# Altium schematic sheet FPGA.SchDoc
size A3; DocumentNumber: 4; SheetNumber: 4; SheetTotal: 30
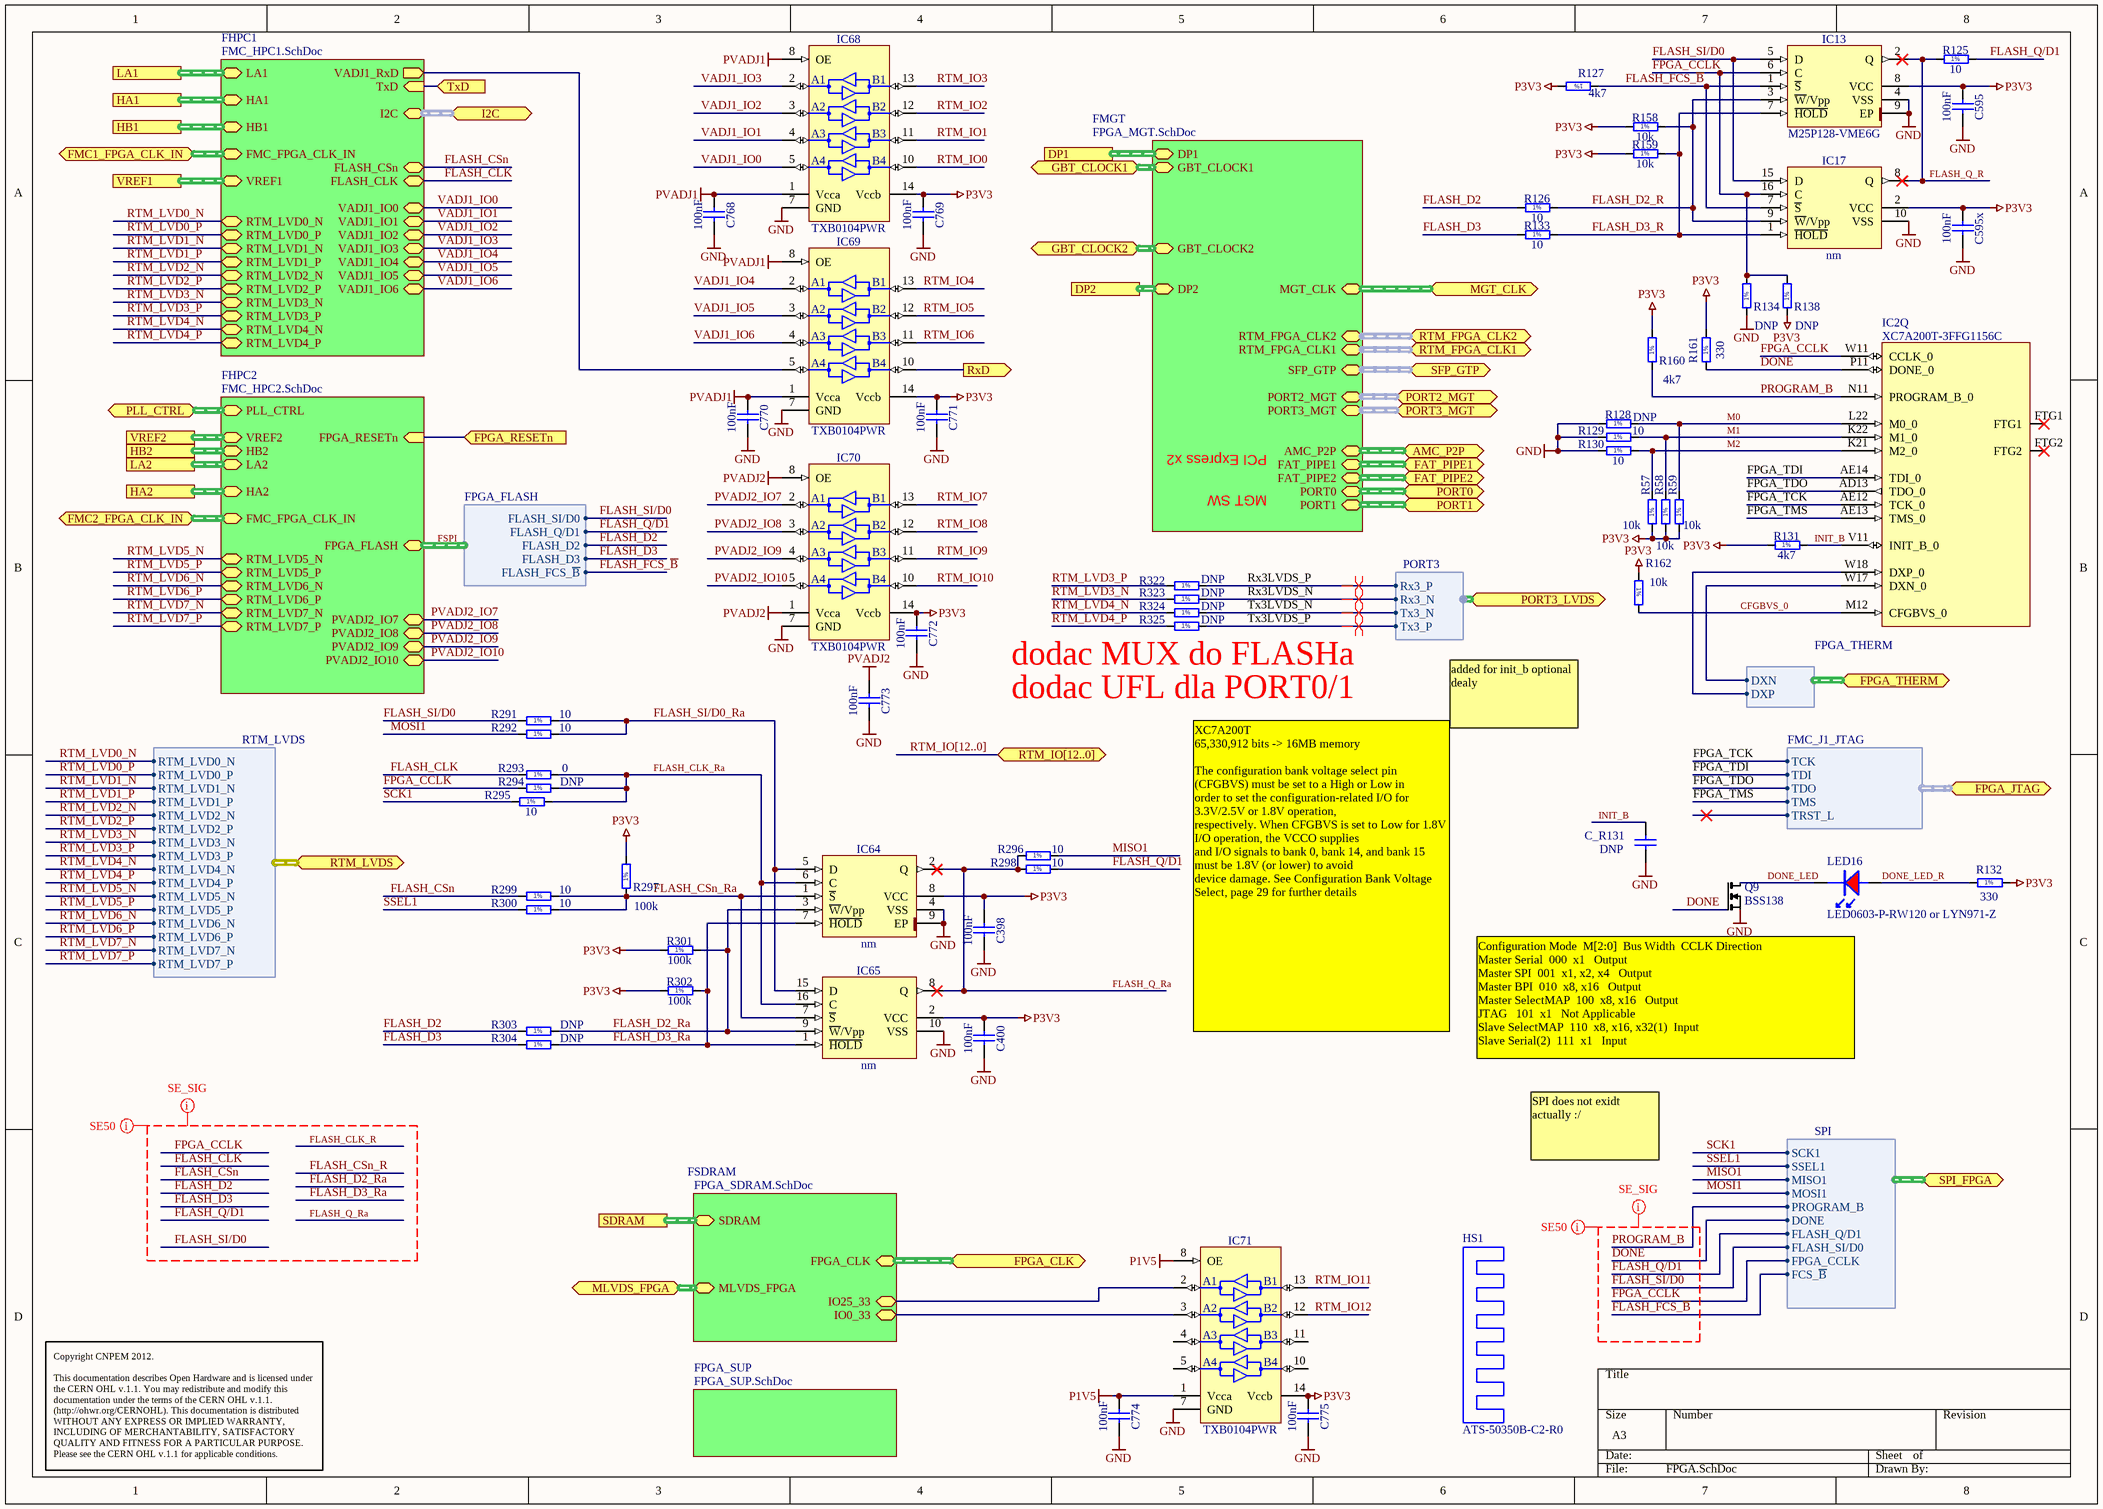
[diagram p0: FPGA.SchDoc]

## Parts
C398  100nF  [CAPC0603X33N]
C400  100nF  [CAPC0603X33N]
C595  100nF  [CAPC0603X33N]
C595x  100nF  [CAPC0603X33N]
C768  100nF  [CAPC0603X33N]
C769  100nF  [CAPC0603X33N]
C770  100nF  [CAPC0603X33N]
C771  100nF  [CAPC0603X33N]
C772  100nF  [CAPC0603X33N]
C773  100nF  [CAPC0603X33N]
C774  100nF  [CAPC0603X33N]
C775  100nF  [CAPC0603X33N]
C_R131  DNP  [CAPC1608X87N]
HS1  ATS-50350B-C2-R0  [HEAT_SINK_ATS-50350B-C2-R0]
IC2  XC7A200T-3FFG1156C  [BGA1156C100P34X34_3500X3500X335]  (part Q of 23)
IC13  M25P128-VME6G  [PSON127P800X600X100-9N-R640X480]
IC17  nm  [SOIC127P1030X265-16N]
IC64  nm  [PSON127P800X600X100-9N-R640X480]
IC65  nm  [SOIC127P1030X265-16N]
IC68  TXB0104PWR  [SOP65P640X120-14N]
IC69  TXB0104PWR  [SOP65P640X120-14N]
IC70  TXB0104PWR  [SOP65P640X120-14N]
IC71  TXB0104PWR  [SOP65P640X120-14N]
LED16  LED0603-P-RW120 or LYN971-Z  [led_0603R]
Q9  BSS138  [SOT95P251X112-3N]
R57  10k  [RESC1005X40N]
R58  10k  [RESC1005X40N]
R59  10k  [RESC1005X40N]
R125  10  [RESC1005X40N]
R126  10  [RESC1005X40N]
R127  4k7  [RESC1005X40N]
R128  DNP  [RESC1005X40N]
R129  10  [RESC1005X40N]
R130  10  [RESC1005X40N]
R131  4k7  [RESC1005X40N]
R132  330  [RESC1005X40N]
R133  10  [RESC1005X40N]
R134  DNP  [RESC1005X40N]
R138  DNP  [RESC1005X40N]
R158  10k  [RESC1005X40N]
R159  10k  [RESC1005X40N]
R160  4k7  [RESC1005X40N]
R161  330  [RESC1005X40N]
R162  10k  [RESC1005X40N]
R291  10  [RESC1005X40N]
R292  10  [RESC1005X40N]
R293  0  [RESC1005X40N]
R294  DNP  [RESC1005X40N]
R295  10  [RESC1005X40N]
R296  10  [RESC1005X40N]
R297  100k  [RESC1005X40N]
R298  10  [RESC1005X40N]
R299  10  [RESC1005X40N]
R300  10  [RESC1005X40N]
R301  100k  [RESC1005X40N]
R302  100k  [RESC1005X40N]
R303  DNP  [RESC1005X40N]
R304  DNP  [RESC1005X40N]
R322  DNP  [RESC1005X40N]
R323  DNP  [RESC1005X40N]
R324  DNP  [RESC1005X40N]
R325  DNP  [RESC1005X40N]

## Sub-sheets
FHPC1 = FMC_HPC1.SchDoc: LA1 (harness FMC_J1_LA), HA1 (harness FMC_J1_HA), HB1 (harness FMC_J1_HB), VREF1 (harness FMC_J1_VREF), FMC_FPGA_CLK_IN (harness FMC_FPGA_CLK_IN), I2C (harness I2C), FLASH_CLK, FLASH_CSn, VADJ1_RxD (out), TxD (in), VADJ1_IO0, VADJ1_IO1, VADJ1_IO2, VADJ1_IO3, VADJ1_IO4, VADJ1_IO5, VADJ1_IO6, RTM_LVD0_N (bidir), RTM_LVD0_P (bidir), RTM_LVD1_N (bidir), RTM_LVD1_P (bidir), RTM_LVD2_N (bidir), RTM_LVD2_P (bidir), RTM_LVD3_N (bidir), RTM_LVD3_P (bidir), RTM_LVD4_N (bidir), RTM_LVD4_P (bidir)
FHPC2 = FMC_HPC2.SchDoc: VREF2 (harness FMC_J1_VREF), HB2 (harness FMC_J1_HB), LA2 (harness FMC_J1_LA), HA2 (harness FMC_J1_HA), FPGA_FLASH (harness FPGA_FLASH), FMC_FPGA_CLK_IN (harness FMC_FPGA_CLK_IN), PLL_CTRL (harness PLL_CTRL), FPGA_RESETn (in), PVADJ2_IO7, PVADJ2_IO8, PVADJ2_IO9, PVADJ2_IO10, RTM_LVD5_N (bidir), RTM_LVD5_P (bidir), RTM_LVD6_N (bidir), RTM_LVD6_P (bidir), RTM_LVD7_N (bidir), RTM_LVD7_P (bidir)
FMGT = FPGA_MGT.SchDoc: DP1 (harness FMC_J1_DP), DP2 (harness FMC_J1_DP), FAT_PIPE1 (harness FAT_PIPE1), FAT_PIPE2 (harness FAT_PIPE2), PORT0 (harness PORT0), PORT1 (harness PORT1), GBT_CLOCK1 (harness GBT_CLOCK), GBT_CLOCK2 (harness GBT_CLOCK), MGT_CLK (harness MGT_CLK), PORT2_MGT, PORT3_MGT, SFP_GTP, RTM_FPGA_CLK2 (harness CLK_DIFF), RTM_FPGA_CLK1 (harness CLK_DIFF), AMC_P2P
FPGA_SUP = FPGA_SUP.SchDoc: no entries
FSDRAM = FPGA_SDRAM.SchDoc: SDRAM (harness DDR), MLVDS_FPGA (harness MLVDS-FPGA), FPGA_CLK (harness FPGA_SDRAM_CLK), IO25_33 (bidir), IO0_33 (bidir)

## Ports
AMC_P2P (harness AMC_P2P), DP1, DP2, FAT_PIPE1, FAT_PIPE2, FMC1_FPGA_CLK_IN, FMC2_FPGA_CLK_IN, FPGA_CLK, FPGA_JTAG (harness FMC_J1_JTAG), FPGA_RESETn (in), FPGA_THERM (harness FPGA_THERM), GBT_CLOCK1, GBT_CLOCK2, HA1, HA2, HB1, HB2, I2C (harness I2C), LA1, LA2, MGT_CLK, MLVDS_FPGA, PLL_CTRL (harness PLL_CTRL), PORT0, PORT1, PORT2_MGT (harness PORT2), PORT3_LVDS (harness PORT3), PORT3_MGT (harness PORT3), RTM_FPGA_CLK1 (harness CLK_DIFF), RTM_FPGA_CLK2 (harness CLK_DIFF), RTM_IO[12..0] (bidir), RTM_LVDS (harness RTM_LVDS), RxD (out), SDRAM (harness DDR), SFP_GTP (harness SFP_GTP), SPI_FPGA (harness SPI), TxD (in), VREF1 (harness FMC_J1_VREF), VREF2 (harness FMC_J1_VREF)

## Harnesses
FMC_J1_JTAG: TCK, TDI, TDO, TMS, TRST_L
FPGA_THERM: DXN, DXP
SPI: SCK1, SSEL1, MISO1, MOSI1, FLASH_Q/D1, FLASH_SI/D0, PROGRAM_B, DONE, FPGA_CCLK, FCS_~{B}
FPGA_FLASH: FLASH_FCS_~{B}, FLASH_D3, FLASH_D2, FLASH_Q/D1, FLASH_SI/D0
RTM_LVDS: RTM_LVD0_N, RTM_LVD0_P, RTM_LVD1_N, RTM_LVD1_P, RTM_LVD2_N, RTM_LVD2_P, RTM_LVD3_N, RTM_LVD3_P, RTM_LVD4_N, RTM_LVD4_P, RTM_LVD5_N, RTM_LVD5_P, RTM_LVD6_N, RTM_LVD6_P, RTM_LVD7_N, RTM_LVD7_P
PORT3: Rx3_P, Rx3_N, Tx3_N, Tx3_P

## Nets
GND: C398.2 C400.2 C595.2 C595x.2 C768.2 C769.2 C770.2 C771.2 C772.2 C773.2 C774.2 C775.2 C_R131.1 IC13.4(VSS) IC13.9(EP) IC17.10(VSS) IC64.4(VSS) IC64.9(EP) IC65.10(VSS) IC68.7(GND) IC69.7(GND) IC70.7(GND) IC71.7(GND) Q9.2(S) R128.1 R129.1 R130.1 R134.1
P1V5: C774.1 IC71.1(Vcca) IC71.8(OE)
P3V3: C398.1 C400.1 C595.1 C595x.1 C769.1 C771.1 C772.1 C775.1 IC13.8(VCC) IC17.2(VCC) IC64.8(VCC) IC65.2(VCC) IC68.14(Vccb) IC69.14(Vccb) IC70.14(Vccb) IC71.14(Vccb) R57.1 R58.1 R59.1 R127.2 R131.1 R132.2 R138.1 R158.1 R159.1 R160.2 R161.2 R162.1 R297.2 R301.1 R302.1
PVADJ1: C768.1 C770.1 IC68.1(Vcca) IC68.8(OE) IC69.1(Vcca) IC69.8(OE)
PVADJ2: C773.1 IC70.1(Vcca) IC70.8(OE)
CFGBVS_0: IC2.M12(CFGBVS_0) R162.2
DONE: IC2.P11(DONE_0) Q9.1(G) R161.1 ; port SPI_FPGA.DONE
DONE_LED: LED16.K Q9.3(D)
DONE_LED_R: LED16.A R132.1
FLASH_CLK: R293.1 ; sheet FHPC1/FLASH_CLK
FLASH_CLK_Ra: IC64.6(C) IC65.16(C) R293.2 R294.2 R295.2
FLASH_CSn: R299.1 ; sheet FHPC1/FLASH_CSn
FLASH_CSn_Ra: IC64.1(~{S}) IC65.7(~{S}) R297.1 R299.2 R300.2
FLASH_D2: R126.1 R303.1 ; sheet FHPC2/FPGA_FLASH.FLASH_D2
FLASH_D2_R: IC13.3(~{W}/Vpp) IC17.9(~{W}/Vpp) R126.2 R158.2
FLASH_D2_Ra: IC64.3(~{W}/Vpp) IC65.9(~{W}/Vpp) R301.2 R303.2
FLASH_D3: R133.1 R304.1 ; sheet FHPC2/FPGA_FLASH.FLASH_D3
FLASH_D3_R: IC13.7(~{HOLD}) IC17.1(~{HOLD}) R133.2 R159.2
FLASH_D3_Ra: IC64.7(~{HOLD}) IC65.1(~{HOLD}) R302.2 R304.2
FLASH_FCS_~{B}: IC13.1(~{S}) IC17.7(~{S}) R127.1 ; port SPI_FPGA.FCS_~{B}, sheet FHPC2/FPGA_FLASH.FLASH_FCS_~{B}
FLASH_Q/D1: R125.2 R298.2 ; port SPI_FPGA.FLASH_Q/D1, sheet FHPC2/FPGA_FLASH.FLASH_Q/D1
FLASH_Q_R: IC13.2(Q) IC17.8(Q) R125.1
FLASH_Q_Ra: IC64.2(Q) IC65.8(Q) R296.1 R298.1
FLASH_SI/D0: IC13.5(D) IC17.15(D) R291.1 ; port SPI_FPGA.FLASH_SI/D0, sheet FHPC2/FPGA_FLASH.FLASH_SI/D0
FLASH_SI/D0_Ra: IC64.5(D) IC65.15(D) R291.2 R292.2
FPGA_CCLK: IC2.W11(CCLK_0) IC13.6(C) IC17.16(C) R134.2 R138.2 R294.1 ; port SPI_FPGA.FPGA_CCLK
FPGA_RESETn: port FPGA_RESETn, sheet FHPC2/FPGA_RESETn
FPGA_TCK: IC2.AE12(TCK_0) ; port FPGA_JTAG.TCK
FPGA_TDI: IC2.AE14(TDI_0) ; port FPGA_JTAG.TDI
FPGA_TDO: IC2.AD13(TDO_0) ; port FPGA_JTAG.TDO
FPGA_TMS: IC2.AE13(TMS_0) ; port FPGA_JTAG.TMS
INIT_B: C_R131.2 IC2.V11(INIT_B_0) R131.2
M0: IC2.L22(M0_0) R59.2 R128.2
M1: IC2.K22(M1_0) R58.2 R129.2
M2: IC2.K21(M2_0) R57.2 R130.2
MISO1: R296.2 ; port SPI_FPGA.MISO1
MOSI1: R292.1 ; port SPI_FPGA.MOSI1
PROGRAM_B: IC2.N11(PROGRAM_B_0) R160.1 ; port SPI_FPGA.PROGRAM_B
PVADJ2_IO7: IC70.2(A1) ; sheet FHPC2/PVADJ2_IO7
PVADJ2_IO8: IC70.3(A2) ; sheet FHPC2/PVADJ2_IO8
PVADJ2_IO9: IC70.4(A3) ; sheet FHPC2/PVADJ2_IO9
PVADJ2_IO10: IC70.5(A4) ; sheet FHPC2/PVADJ2_IO10
RTM_IO0: IC68.10(B4)
RTM_IO1: IC68.11(B3)
RTM_IO2: IC68.12(B2)
RTM_IO3: IC68.13(B1)
RTM_IO4: IC69.13(B1)
RTM_IO5: IC69.12(B2)
RTM_IO6: IC69.11(B3)
RTM_IO7: IC70.13(B1)
RTM_IO8: IC70.12(B2)
RTM_IO9: IC70.11(B3)
RTM_IO10: IC70.10(B4)
RTM_IO11: IC71.13(B1)
RTM_IO12: IC71.12(B2)
RTM_LVD0_N: sheet FHPC1/RTM_LVD0_N, port RTM_LVDS.RTM_LVD0_N
RTM_LVD0_P: sheet FHPC1/RTM_LVD0_P, port RTM_LVDS.RTM_LVD0_P
RTM_LVD1_N: sheet FHPC1/RTM_LVD1_N, port RTM_LVDS.RTM_LVD1_N
RTM_LVD1_P: sheet FHPC1/RTM_LVD1_P, port RTM_LVDS.RTM_LVD1_P
RTM_LVD2_N: sheet FHPC1/RTM_LVD2_N, port RTM_LVDS.RTM_LVD2_N
RTM_LVD2_P: sheet FHPC1/RTM_LVD2_P, port RTM_LVDS.RTM_LVD2_P
RTM_LVD3_N: R323.1 ; sheet FHPC1/RTM_LVD3_N, port RTM_LVDS.RTM_LVD3_N
RTM_LVD3_P: R322.1 ; sheet FHPC1/RTM_LVD3_P, port RTM_LVDS.RTM_LVD3_P
RTM_LVD4_N: R324.1 ; sheet FHPC1/RTM_LVD4_N, port RTM_LVDS.RTM_LVD4_N
RTM_LVD4_P: R325.1 ; sheet FHPC1/RTM_LVD4_P, port RTM_LVDS.RTM_LVD4_P
RTM_LVD5_N: sheet FHPC2/RTM_LVD5_N, port RTM_LVDS.RTM_LVD5_N
RTM_LVD5_P: sheet FHPC2/RTM_LVD5_P, port RTM_LVDS.RTM_LVD5_P
RTM_LVD6_N: sheet FHPC2/RTM_LVD6_N, port RTM_LVDS.RTM_LVD6_N
RTM_LVD6_P: sheet FHPC2/RTM_LVD6_P, port RTM_LVDS.RTM_LVD6_P
RTM_LVD7_N: sheet FHPC2/RTM_LVD7_N, port RTM_LVDS.RTM_LVD7_N
RTM_LVD7_P: sheet FHPC2/RTM_LVD7_P, port RTM_LVDS.RTM_LVD7_P
Rx3LVDS_N: R323.2 ; port PORT3_LVDS.Rx3_N
Rx3LVDS_P: R322.2 ; port PORT3_LVDS.Rx3_P
RxD: IC69.10(B4) ; port RxD
SCK1: R295.1 ; port SPI_FPGA.SCK1
SSEL1: R300.1 ; port SPI_FPGA.SSEL1
Tx3LVDS_N: R324.2 ; port PORT3_LVDS.Tx3_N
Tx3LVDS_P: R325.2 ; port PORT3_LVDS.Tx3_P
TxD: port TxD, sheet FHPC1/TxD
VADJ1_IO0: IC68.5(A4) ; sheet FHPC1/VADJ1_IO0
VADJ1_IO1: IC68.4(A3) ; sheet FHPC1/VADJ1_IO1
VADJ1_IO2: IC68.3(A2) ; sheet FHPC1/VADJ1_IO2
VADJ1_IO3: IC68.2(A1) ; sheet FHPC1/VADJ1_IO3
VADJ1_IO4: IC69.2(A1) ; sheet FHPC1/VADJ1_IO4
VADJ1_IO5: IC69.3(A2) ; sheet FHPC1/VADJ1_IO5
VADJ1_IO6: IC69.4(A3) ; sheet FHPC1/VADJ1_IO6
NetIC2_W17: IC2.W17(DXN_0) ; port FPGA_THERM.DXN
NetIC2_W18: IC2.W18(DXP_0) ; port FPGA_THERM.DXP
NetIC69_5: IC69.5(A4) ; sheet FHPC1/VADJ1_RxD
NetIC71_2: IC71.2(A1) ; sheet FSDRAM/IO25_33
NetIC71_3: IC71.3(A2) ; sheet FSDRAM/IO0_33

Not connected (* = marked no-connect by the designer): IC2 FTG1* FTG2*; IC71 4(A3) 5(A4) 10(B4) 11(B3)

## Buses and harness runs
bus RTM_IO[12..0] = port RTM_IO[12..0]
harness FSPI = sheet FHPC2/FPGA_FLASH
harness port AMC_P2P = sheet FMGT/AMC_P2P
harness port DP1 = sheet FMGT/DP1
harness port DP2 = sheet FMGT/DP2
harness port FAT_PIPE1 = sheet FMGT/FAT_PIPE1
harness port FAT_PIPE2 = sheet FMGT/FAT_PIPE2
harness port FMC1_FPGA_CLK_IN = sheet FHPC1/FMC_FPGA_CLK_IN
harness port FMC2_FPGA_CLK_IN = sheet FHPC2/FMC_FPGA_CLK_IN
harness port FPGA_CLK = sheet FSDRAM/FPGA_CLK
harness port GBT_CLOCK1 = sheet FMGT/GBT_CLOCK1
harness port GBT_CLOCK2 = sheet FMGT/GBT_CLOCK2
harness port HA1 = sheet FHPC1/HA1
harness port HA2 = sheet FHPC2/HA2
harness port HB1 = sheet FHPC1/HB1
harness port HB2 = sheet FHPC2/HB2
harness port I2C = sheet FHPC1/I2C
harness port LA1 = sheet FHPC1/LA1
harness port LA2 = sheet FHPC2/LA2
harness port MGT_CLK = sheet FMGT/MGT_CLK
harness port MLVDS_FPGA = sheet FSDRAM/MLVDS_FPGA
harness port PLL_CTRL = sheet FHPC2/PLL_CTRL
harness port PORT0 = sheet FMGT/PORT0
harness port PORT1 = sheet FMGT/PORT1
harness port PORT2_MGT = sheet FMGT/PORT2_MGT
harness port PORT3_MGT = sheet FMGT/PORT3_MGT
harness port RTM_FPGA_CLK1 = sheet FMGT/RTM_FPGA_CLK1
harness port RTM_FPGA_CLK2 = sheet FMGT/RTM_FPGA_CLK2
harness port SDRAM = sheet FSDRAM/SDRAM
harness port SFP_GTP = sheet FMGT/SFP_GTP
harness port VREF1 = sheet FHPC1/VREF1
harness port VREF2 = sheet FHPC2/VREF2

## Layout directives
net class SE_SIG: DONE, FLASH_CLK, FLASH_CLK_R, FLASH_CSn, FLASH_CSn_R, FLASH_D2, FLASH_D2_Ra, FLASH_D3, FLASH_D3_Ra, FLASH_FCS_~{B}, FLASH_Q/D1, FLASH_Q_Ra, FLASH_SI/D0, FPGA_CCLK, PROGRAM_B
net class SE50: DONE, FLASH_CLK, FLASH_CLK_R, FLASH_CSn, FLASH_CSn_R, FLASH_D2, FLASH_D2_Ra, FLASH_D3, FLASH_D3_Ra, FLASH_FCS_~{B}, FLASH_Q/D1, FLASH_Q_Ra, FLASH_SI/D0, FPGA_CCLK, PROGRAM_B
differential pair: Rx3LVDS_N, Rx3LVDS_P, Tx3LVDS_N, Tx3LVDS_P

## Notes on the sheet
- PCI Express x2
- MGT SW
- (near R325) dodac MUX do FLASHa
- dodac UFL dla PORT0/1
- added for init_b optional dealy
- XC7A200T
  65,330,912 bits -> 16MB memory
  The configuration bank voltage select pin (CFGBVS) must be set to a High or Low in
  order to set the configuration-related I/O for 3.3V/2.5V or 1.8V operation,
  respectively. When CFGBVS is set to Low for 1.8V I/O operation, the VCCO supplies
  and I/O signals to bank 0, bank 14, and bank 15 must be 1.8V (or lower) to avoid
  device damage. See Configuration Bank Voltage Select, page 29 for further details
- (near Q9) Configuration Mode 	M[2:0] 	Bus Width 	CCLK Direction
  Master Serial 	000 	x1 		Output
  Master SPI 	001 	x1, x2, x4 		Output
  Master BPI 	010 	x8, x16 		Output
  Master SelectMAP 	100 	x8, x16 		Output
  JTAG 		101 	x1 		Not Applicable
  Slave SelectMAP 	110	 x8, x16, x32(1) 	Input
  Slave Serial(2) 	111 	x1 		Input
- SPI does not exidt actually :/
- Copyright CNPEM 2012.
  This documentation describes Open Hardware and is licensed under the CERN OHL v.1.1. You may redistribute and modify this documentation under the terms of the CERN OHL v.1.1. (http://ohwr.org/CERNOHL). This documentation is distributed WITHOUT ANY EXPRESS OR IMPLIED WARRANTY, INCLUDING OF MERCHANTABILITY, SATISFACTORY QUALITY AND FITNESS FOR A PARTICULAR PURPOSE. Please see the CERN OHL v.1.1 for applicable conditions.
- (in symbol R0402_0R_JUMPER) 1%
- (in symbol R0402_4K7_1%_0.0625W_100PPM) 1%
- (in symbol R0402_10K_1%_0.0625W_100PPM) 1%
- (in symbol R0402_10R_1%_0.0625W_200PPM) 1%
- (in symbol R0402_100K_1%_0.0625W_100PPM) 1%
- (in symbol R0402_100R_1%_0.0625W_100PPM) 1%
- (in symbol R0402_330R_1%_0.0625W_100PPM) 1%

## Library data of the parts
C398 C400 C595 C595x C768-C775 = CC0201_100NF_6.3V_10%_X5R: Non-polarised capacitor; Part Description: SMD Multilayer Chip Ceramic Capacitor; Manufacturer: GENERIC; Manufacturer1 Part Number: 02016D104KAT2A; Voltage: 6.3V; TC: X5R; Tolerance: ±10%; Table: Capacitors SMD; Part Number: CC0201_100NF_6.3V_10%_X5R; Component Kind: Standard; Component Type: Standard; Pin Count: 2; Value: 100nF; Status: Not Recommended; Manufacturer Part Number: CC0201_100NF_6.3V_10%_X5R; Case: 0201; Mounted: Yes; Socket: No; SMD: Yes; Manufacturer1 Example: AVX; Manufacturer1 ComponentHeight: 0.33mm; HelpURL: \\cern.ch\dfs\Applications\Altium\Datasheets\CC0201_X5R_AVX.pdf; Author: CERN DEM JLC; CreateDate: 2007-12-03; LatestRevisionDate: 2007-12-03
C_R131 = CC0603_1UF_16V_10%_X7R: Non-polarised capacitor; Part Description: SMD Multilayer Chip Ceramic Capacitor; Manufacturer: GENERIC; Manufacturer1 Part Number: 223824613663; Value: 1uF; Voltage: 16V; TC: X7R; Tolerance: ±10%; Table: Capacitors SMD; Part Number: CC0603_1UF_16V_10%_X7R; Component Kind: Standard; Component Type: Standard; Pin Count: 2; Status: Preferred; Manufacturer Part Number: CC0603_1uF_16V_10%_X7R; Case: 0603; Mounted: Yes; Socket: No; SMD: Yes; Manufacturer1 Example: PHYCOMP; Manufacturer1 ComponentHeight: 0.87mm; HelpURL: \\cern.ch\dfs\Applications\Altium\Datasheets\CC0805_X5R_PHYCOMP_HC.pdf; Author: CERN DEM JLC; CreateDate: 2007-12-03; LatestRevisionDate: 2007-12-03
HS1 = HEAT_SINK_ATS-50350B-C2-R0: Heat sink BGA 35x35(44.9)mm
IC2 = XC7A350T-2FFG1156C: Artix-6 FPGA, 16 GTPs, 600 User I/Os, 1156-Pin BGA, Speed Grade 2, Commercial Grade, Pb-Free; Part Description: Artix-7 FPGA, 16 GTPs, 600 User I/Os, 1156-Pin BGA, Speed Grade 2, Commercial Grade, Pb-Free; Manufacturer: XILINX; Table: Logic; Part Number: XC7A200T-3FFG1156C; Component Kind: Standard; Component Type: Standard; Device: XC7A200T-3FFG1156C; PackageDescription: BGA, 1.00mm Pitch, Square; 1156 Pin, 34 Columns X 34 Rows, 35.00mm X 35.00mm X 3.350mm H; Manufacturer Part Number: XC7A200T-3FFG1156C; Pin Count: 1156; Case: BGA1156; Mounted: Yes; Socket: No; SMD: Yes; ComponentHeight: 3.35mm; HelpURL: \\cern.ch\dfs\Applications\Altium\Datasheets\XC7A350T-2FFG1156C.pdf; ComponentLink1URL: \\cern.ch\dfs\Applications\Altium\Datasheets\XC7A350T-2FFG1156C.pdf; ComponentLink1Description: Package/Pinout; Author: CERN DEM JLC; CreateDate: 2012-09-19; LatestRevisionDate: 2012-09-19
IC13 IC64 = M25P128-VME6G: 128 Mbit (Multilevel), low-voltage, Serial Flash memory with 50-MHz SPI bus interface; Manufacturer: NUMONYX; Table: Logic; Part Number: M25P128-VME6G; Component Kind: Standard; Component Type: Standard; Device: M25P128-VME6G; PackageDescription: SON,1.27mm,pitch; 8 pin,8.00mm W X 6.00mm L X 1.00mm H body (w/pullback leads,thermal tab 6.4 X 4.8mm), IPC Medium Density; Part Description: 128 Mbit (Multilevel), Low-Voltage, Serial Flash Memory With 50-MHz SPI Bus Interface; Manufacturer Part Number: M25P128-VME6G; Pin Count: 9; Case: SON8; Mounted: Yes; Socket: No; SMD: Yes; ComponentHeight: 1mm; HelpURL: \\cern.ch\dfs\Applications\Altium\Datasheets\M25P128-VME6G.pdf; Author: CERN DEM JLC; CreateDate: 2010-01-20; LatestRevisionDate: 2010-01-20
IC17 IC65 = M25P128-VMF6G: 128 Mbit (Multilevel), low-voltage, Serial Flash memory with 50-MHz SPI bus interface; Manufacturer: NUMONYX; Table: Logic; Part Number: M25P128-VMF6G; Component Kind: Standard; Component Type: Standard; Device: M25P128-VMF6G; PackageDescription: SOIC 16, Pitch 1.27mm - Body 7.5x10.3mm, IPC Medium Density; Part Description: 128 Mbit (Multilevel), Low-Voltage, Serial Flash Memory With 50-MHz SPI Bus Interface; Manufacturer Part Number: M25P128-VMF6G; Pin Count: 8; Case: SOIC16; Mounted: Yes; Socket: No; SMD: Yes; ComponentHeight: 2.65mm; HelpURL: \\cern.ch\dfs\Applications\Altium\Datasheets\M25P128-VMF6G.pdf; Author: CERN DEM JLC; CreateDate: 2010-01-20; LatestRevisionDate: 2010-10-21
IC68-IC71 = TXB0104PWR: 4-Bit Bidirectionnal Voltage-Level Translator; Part Description: 4-Bit Bidirectional Voltage-Level Translator with Automatic Direction Sensing and ±15kV ESD Protection; Manufacturer: TEXAS INSTRUMENTS; Table: Analog & Interface; Part Number: TXB0104PWR; Component Kind: Standard; Component Type: Standard; Device: TXB0104PWR; PackageDescription: SOP, 14-Leads, Body 5.1x4.5mm (max), Pitch 0.65mm, IPC Medium Density; Manufacturer Part Number: TXB0104PWR; Pin Count: 14; Case: TSSOP14; Mounted: Yes; Socket: No; SMD: Yes; ComponentHeight: 1.2mm; Author: CERN DEM JMW; HelpURL: \\cern.ch\dfs\Applications\Altium\Datasheets\TXB0104PWR.pdf; CreateDate: 2010-12-20; LatestRevisionDate: 2010-12-20
LED16 = LED_0603R: LED 0603 red; Supplier 1: Newark; Supplier Part Number 1: 22M3004; Supplier 2: Newark; Supplier Part Number 2: 20M0618
Q9 = Q_BSS138
R57-R59 R158 R159 R162 = R0402_10K_1%_0.0625W_100PPM: Resistor - 1%; Part Description: General Purpose Thick Film Chip Resistor; Manufacturer: GENERIC; Manufacturer1 Part Number: 232270671003L; TC: ±100ppm/°C; Table: Resistors SMD; Part Number: R0402_10K_1%_0.0625W_100PPM; Component Kind: Standard; Component Type: Standard; Pin Count: 2; Value: 10k; Status: Not recommended; Power: 0.0625W; Tolerance: ±1%; Manufacturer Part Number: R0402_10K_1%_0.0625W_100PPM; Case: 0402; Mounted: Yes; Socket: No; SMD: Yes; Manufacturer1 Example: YAGEO PHYCOMP; Manufacturer1 ComponentHeight: 0.4mm; HelpURL: \\cern.ch\dfs\Applications\Altium\Datasheets\R0402_Phycomp_RC0402.pdf; Author: CERN DEM JLC; CreateDate: 2007-12-03; LatestRevisionDate: 2012-10-17
R125 R126 R129 R130 R133 R291 R292 R295 R296 R298-R300 = R0402_10R_1%_0.0625W_200PPM: Resistor - 1%; Part Description: General Purpose Thick Film Chip Resistor; Manufacturer: GENERIC; Manufacturer1 Part Number: 232270671009L; TC: ±200ppm/°C; Table: Resistors SMD; Part Number: R0402_10R_1%_0.0625W_200PPM; Component Kind: Standard; Component Type: Standard; Pin Count: 2; Value: 10; Status: Not recommended; Power: 0.0625W; Tolerance: ±1%; Manufacturer Part Number: R0402_10R_1%_0.0625W_200PPM; Case: 0402; Mounted: Yes; Socket: No; SMD: Yes; Manufacturer1 Example: YAGEO PHYCOMP; Manufacturer1 ComponentHeight: 0.4mm; HelpURL: \\cern.ch\dfs\Applications\Altium\Datasheets\R0402_Phycomp_RC0402.pdf; Author: CERN DEM JLC; CreateDate: 2009-06-24; LatestRevisionDate: 2012-10-17
R127 R131 R160 = R0402_4K7_1%_0.0625W_100PPM: Resistor - 1%; Part Description: General Purpose Thick Film Chip Resistor; Manufacturer: GENERIC; Manufacturer1 Part Number: 232270674702L; TC: ±100ppm/°C; Table: Resistors SMD; Part Number: R0402_4K7_1%_0.0625W_100PPM; Component Kind: Standard; Component Type: Standard; Pin Count: 2; Value: 4k7; Status: Not recommended; Power: 0.0625W; Tolerance: ±1%; Manufacturer Part Number: R0402_4K7_1%_0.0625W_100PPM; Case: 0402; Mounted: Yes; Socket: No; SMD: Yes; Manufacturer1 Example: YAGEO PHYCOMP; Manufacturer1 ComponentHeight: 0.4mm; HelpURL: \\cern.ch\dfs\Applications\Altium\Datasheets\R0402_Phycomp_RC0402.pdf; Author: CERN DEM JLC; CreateDate: 2007-12-03; LatestRevisionDate: 2012-10-17
R128 R294 R303 R304 R322-R325 = R0402_0R_JUMPER: Resistor - 1%; Part Description: 1A (0.05R Max DC Resistance) Zero Ohm Jumper; Manufacturer: GENERIC; Manufacturer1 Part Number: 232270591001L; Value: 0; Table: Resistors SMD; Part Number: R0402_0R_JUMPER; Component Kind: Standard; Component Type: Standard; Pin Count: 2; Status: Not recommended; Manufacturer Part Number: R0402_0R_JUMPER; Case: 0402; Mounted: Yes; Socket: No; SMD: Yes; Manufacturer1 Example: YAGEO PHYCOMP; Manufacturer1 ComponentHeight: 0.4mm; HelpURL: \\cern.ch\dfs\Applications\Altium\Datasheets\R0402_Phycomp_RC0402.pdf; Author: CERN DEM JLC; CreateDate: 2007-12-03; LatestRevisionDate: 2012-10-17
R132 R161 = R0402_330R_1%_0.0625W_100PPM: Resistor - 1%; Part Description: General Purpose Thick Film Chip Resistor; Manufacturer: GENERIC; Manufacturer1 Part Number: 232270673301L; TC: ±100ppm/°C; Table: Resistors SMD; Part Number: R0402_330R_1%_0.0625W_100PPM; Component Kind: Standard; Component Type: Standard; Pin Count: 2; Value: 330; Status: Not recommended; Power: 0.0625W; Tolerance: ±1%; Manufacturer Part Number: R0402_330R_1%_0.0625W_100PPM; Case: 0402; Mounted: Yes; Socket: No; SMD: Yes; Manufacturer1 Example: YAGEO PHYCOMP; Manufacturer1 ComponentHeight: 0.4mm; HelpURL: \\cern.ch\dfs\Applications\Altium\Datasheets\R0402_Phycomp_RC0402.pdf; Author: CERN DEM JLC; CreateDate: 2007-12-03; LatestRevisionDate: 2012-10-17
R134 R138 = R0402_100R_1%_0.0625W_100PPM: Resistor - 1%; Part Description: General Purpose Thick Film Chip Resistor; Manufacturer: GENERIC; Manufacturer1 Part Number: 232270671001L; Value: 100; TC: ±100ppm/°C; Table: Resistors SMD; Part Number: R0402_100R_1%_0.0625W_100PPM; Component Kind: Standard; Component Type: Standard; Pin Count: 2; Status: Not recommended; Power: 0.0625W; Tolerance: ±1%; Manufacturer Part Number: R0402_100R_1%_0.0625W_100PPM; Case: 0402; Mounted: Yes; Socket: No; SMD: Yes; Manufacturer1 Example: YAGEO PHYCOMP; Manufacturer1 ComponentHeight: 0.4mm; HelpURL: \\cern.ch\dfs\Applications\Altium\Datasheets\R0402_Phycomp_RC0402.pdf; Author: CERN DEM JLC; CreateDate: 2007-12-03; LatestRevisionDate: 2012-10-17
R293 = R0402_0R_JUMPER: Resistor - 1%; Part Description: 1A (0.05R Max DC Resistance) Zero Ohm Jumper; Manufacturer: GENERIC; Manufacturer1 Part Number: 232270591001L; Table: Resistors SMD; Part Number: R0402_0R_JUMPER; Component Kind: Standard; Component Type: Standard; Pin Count: 2; Value: 0; Status: Not recommended; Manufacturer Part Number: R0402_0R_JUMPER; Case: 0402; Mounted: Yes; Socket: No; SMD: Yes; Manufacturer1 Example: YAGEO PHYCOMP; Manufacturer1 ComponentHeight: 0.4mm; HelpURL: \\cern.ch\dfs\Applications\Altium\Datasheets\R0402_Phycomp_RC0402.pdf; Author: CERN DEM JLC; CreateDate: 2007-12-03; LatestRevisionDate: 2012-10-17
R297 R301 R302 = R0402_100K_1%_0.0625W_100PPM: Resistor - 1%; Part Description: General Purpose Thick Film Chip Resistor; Manufacturer: GENERIC; Manufacturer1 Part Number: 232270671004L; TC: ±100ppm/°C; Table: Resistors SMD; Part Number: R0402_100K_1%_0.0625W_100PPM; Component Kind: Standard; Component Type: Standard; Pin Count: 2; Value: 100k; Status: Not recommended; Power: 0.0625W; Tolerance: ±1%; Manufacturer Part Number: R0402_100K_1%_0.0625W_100PPM; Case: 0402; Mounted: Yes; Socket: No; SMD: Yes; Manufacturer1 Example: YAGEO PHYCOMP; Manufacturer1 ComponentHeight: 0.4mm; HelpURL: \\cern.ch\dfs\Applications\Altium\Datasheets\R0402_Phycomp_RC0402.pdf; Author: CERN DEM JLC; CreateDate: 2007-12-03; LatestRevisionDate: 2012-10-17